# EasyEDA Pro project OSC1.eprj, board 编码器-3
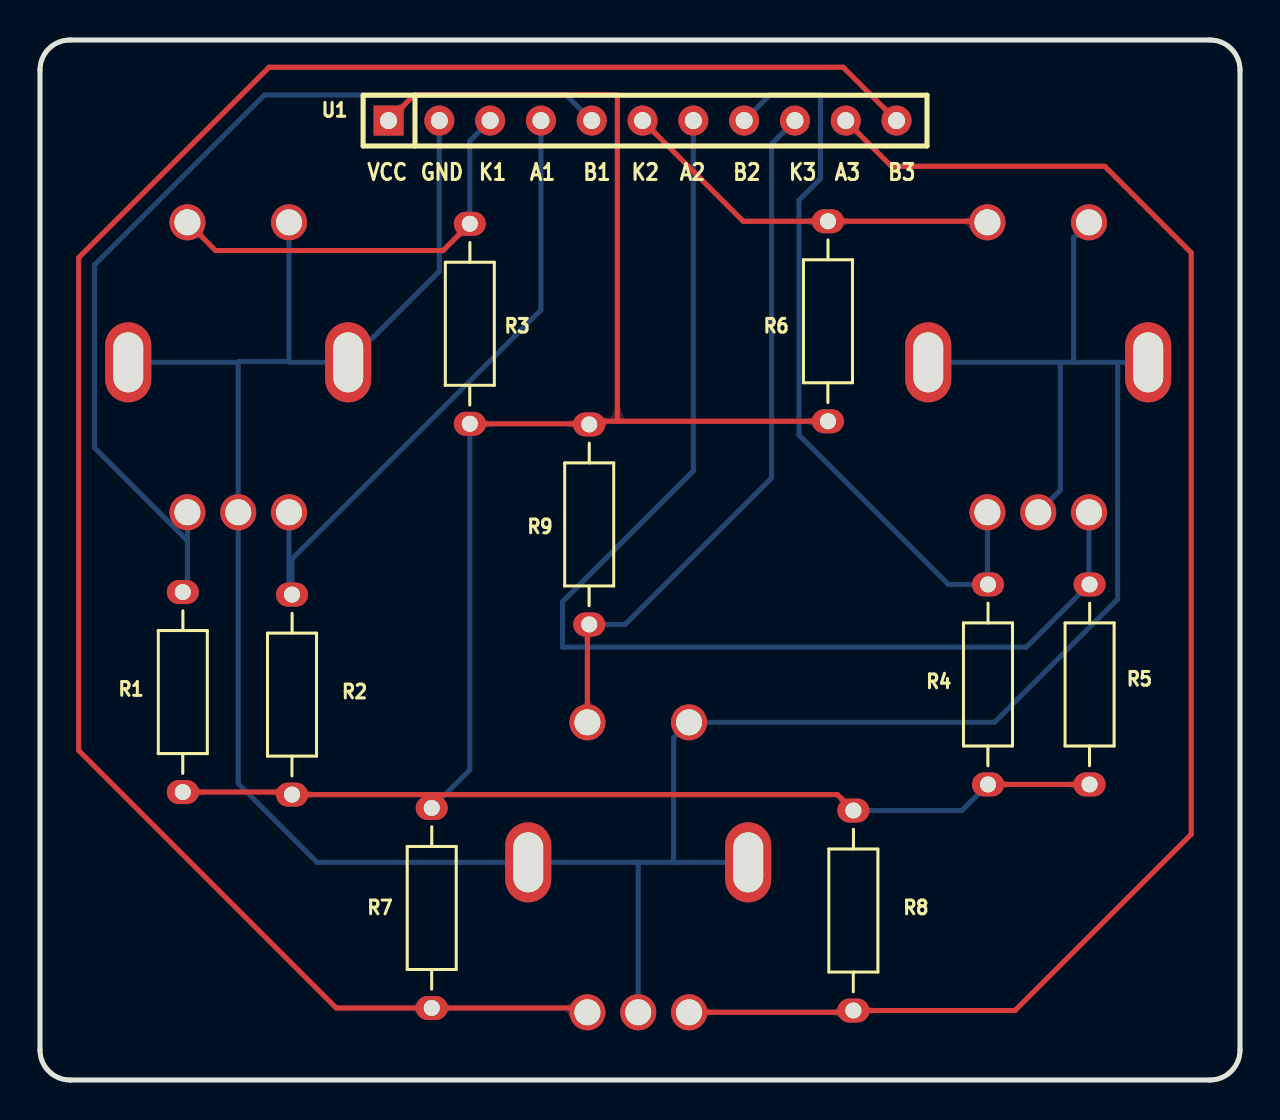
[diagram p13: board, top side]
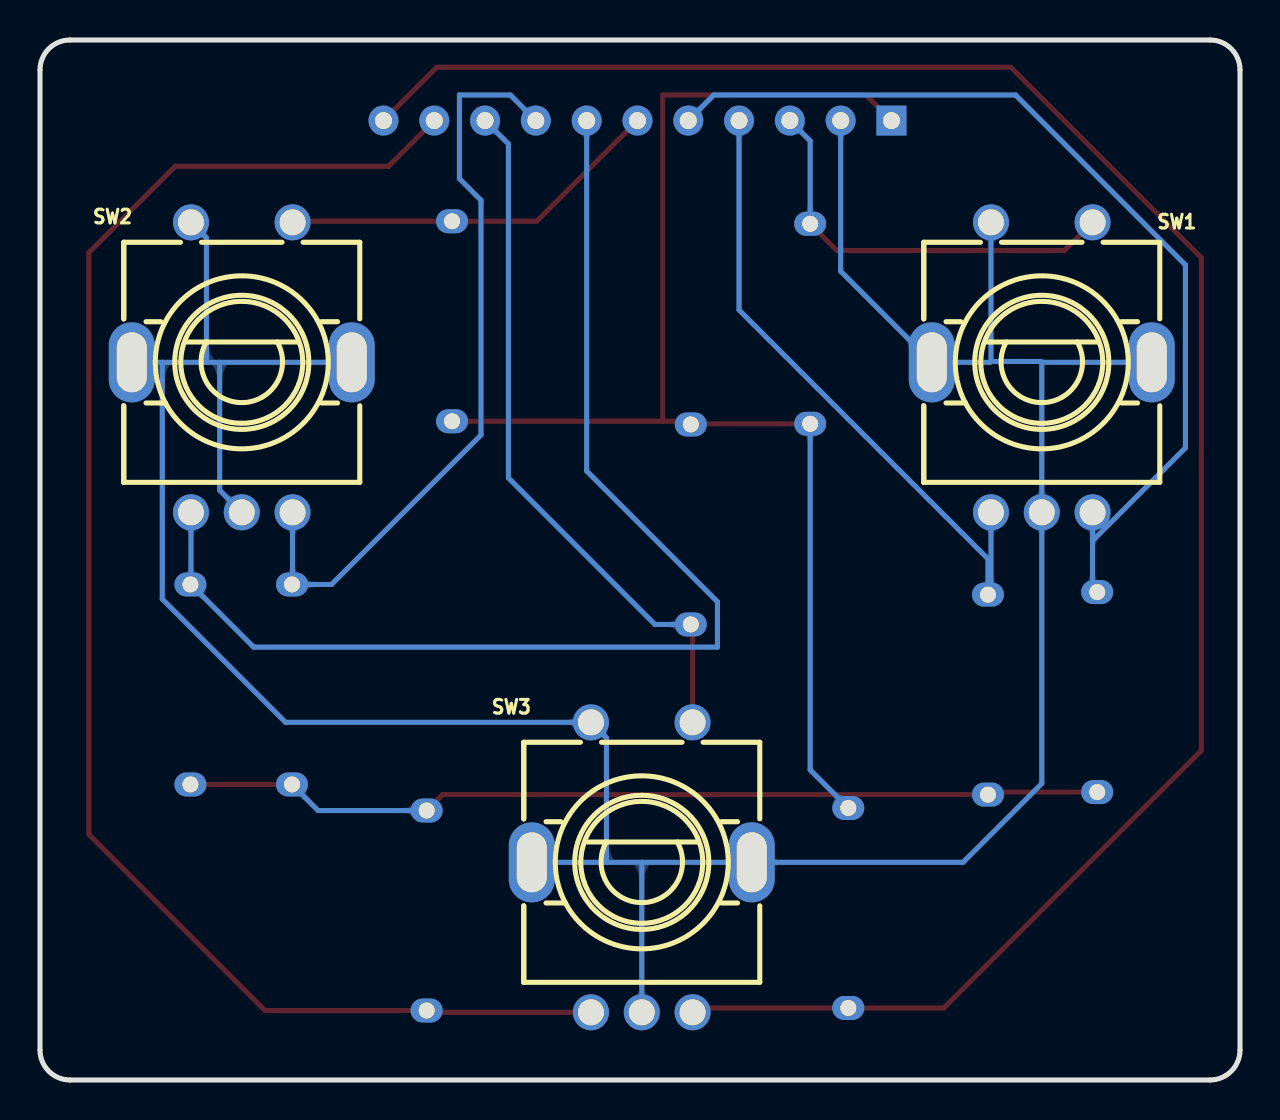
[diagram p14: board, bottom side, seen from below]

Outline 60 x 52 mm; copper layers: Top Layer, Bottom Layer. Coordinates in mm from the lower left corner of the outline.
Outline path: 0,50.5 0,1.5 arc(0.44,0.44) 1.5,0 58.5,0 arc(59.56,0.44) 60,1.5 60,50.5 arc(59.56,51.56) 58.5,52 1.5,52 arc(0.44,51.56) 0,50.5
Stack: Top Layer 0.035mm / Dielectric1 1.51mm FR4 er 4.5 / Bottom Layer 0.035mm

## Design rules (mm)
template: 自定义配置1
spacing copperThickness1oz (default): track to track 0.203, other pairs 0.203 to 0.203
spacing copperThickness2oz: track to track 0.203, other pairs 0.152 to 0.3
track width copperThickness1oz (default): min 0.254, default 0.254, max 2.54
track width copperThickness2oz: min 0.203, default 0.254, max 2.54
track width 5VandGND: min 0.254, default 0.762, max 2.54
differential pair differentialPair (default): width min 0.127, default 0.254, max 2.54; gap min 0.152, default 0.152
via viaSize (default): diameter min 0.5, default 0.61, max 10; hole min 0.3, default 0.305, max 6.299

## Placement (name value [footprint] x y rotation side)
R1  10K  [240*80mil]  7.14 19.4 270 top
R2  10K  [240*80mil]  12.6 19.27 270 top
R3  10K  [240*80mil]  21.49 37.81 270 top
R4  10K  [240*80mil]  47.4 19.78 270 top
R5  10K  [240*80mil]  52.48 19.78 270 top
R6  10K  [240*80mil]  39.4 37.94 270 top
R7  10K  [240*80mil]  19.59 8.6 90 top
R8  10K  [240*80mil]  40.67 8.47 90 top
R9  10K  [240*80mil]  27.46 27.78 90 top
SW1  -  [旋转编码器]  9.91 35.91 180 bottom
SW2  -  [旋转编码器]  49.91 35.91 180 bottom
SW3  -  [旋转编码器]  29.91 10.91 180 bottom
U1  -  [CH2.54-11插座]  28.73 47.97 0 top

## Footprints (pads in the part's own frame, mm; a bottom-side part is the same pattern mirrored in y, then rotated)
240*80mil
  oval 1.2x1.6 hole 0.8: 1(-5,0) 2(5,0)
CH2.54-11插座
  rect 1.5x1.5 hole 0.85: 1(-11.303,0)
  round 1.5 hole 0.85: 2(-8.763,0) 3(-6.223,0) 4(-3.683,0) 5(-1.143,0) 6(1.397,0) 7(3.937,0) 8(6.477,0) 9(9.017,0) 10(11.557,0) 11(14.097,0)
旋转编码器
  oval 2.301x4 hole 1.501x2.999: 6(5.499,-0.023) 7(-5.499,-0.023)
  round 1.801 hole 1.3: A(-2.54,-7.521) B(2.54,-7.521) C(0,-7.521) D(-2.54,6.977) E(2.54,6.977)

## Nets
As in the schematic.

## Routing (per net, layer and track width the routed paths; a pad name or vN(x,y) marks a point on that pad's centre or on a via; arc(x,y) is an arc through that point)
GND: length 157.1
  Bottom Layer w0.254: 31.68,10.88 SW3.7 ; 31.68,10.88 31.68,17.11 SW3.D 47.72,17.88 53.88,24.05 53.88,35.88 ; 31.68,10.88 29.91,10.88 ; 12.45,35.93 12.49,35.88 SW1.7 19.97,40.44 19.97,47.97 ; 12.45,35.93 SW1.D ; 12.45,35.93 9.95,35.93 9.91,35.88 ; 29.91,3.38 29.91,10.88 ; 29.91,10.88 SW3.6 13.85,10.88 9.91,14.82 SW1.C 9.91,35.88 ; SW2.C 51.02,29.49 51.02,35.88 ; SW2.6 51.02,35.88 ; 51.02,35.88 51.68,35.88 ; SW2.7 53.88,35.88 ; 53.88,35.88 51.68,35.88 ; SW2.D 51.68,42.11 51.68,35.88 ; 9.91,35.88 SW1.6
VCC: length 113.2
  Top Layer w0.254: U1.1 18.71,49.25 28.87,49.25 28.87,32.94 ; 27.46,32.81 27.59,32.94 28.87,32.94 ; 27.46,32.81 R3.2 ; 27.46,32.81 R9.2 ; 19.59,14.27 R2.2 12.47,14.4 R1.2 ; 19.59,14.27 R7.2 ; 19.59,14.27 39.87,14.27 R8.2 ; R5.2 R4.2 ; 28.87,32.94 R6.2
  Bottom Layer w0.254: R4.2 46.1,13.47 R8.2 ; R7.2 21.49,15.51 R3.2
A1: length 33
  Bottom Layer w0.254: SW1.A 12.45,24.42 R2.1 12.6,26.06 25.05,38.5 U1.4
A2: length 60.3
  Bottom Layer w0.254: 52.45,24.78 49.32,21.64 26.13,21.64 26.13,23.91 32.67,30.45 U1.7 ; 52.45,24.78 R5.1 ; 52.45,24.78 SW2.A
A3: length 77.9
  Top Layer w0.254: 32.45,3.38 40.58,3.38 R8.1 48.75,3.47 57.56,12.28 57.56,41.37 53.24,45.69 42.57,45.69 40.29,47.97
B1: length 48.7
  Bottom Layer w0.254: U1.5 26.31,49.25 11.22,49.25 2.73,40.75 2.73,31.61 7.37,26.97 ; R1.1 7.37,24.63 7.37,26.97 ; 7.37,26.97 SW1.B
B2: length 37.9
  Bottom Layer w0.254: R4.1 47.37,24.78 ; 47.37,24.78 45.42,24.78 37.95,32.25 37.95,43.99 39.03,45.07 39.03,49.25 36.49,49.25 U1.8 ; 47.37,24.78 SW2.B
B3: length 101.4
  Top Layer w0.254: U1.11 40.16,50.64 11.46,50.64 1.93,41.11 1.93,16.48 14.81,3.6 R7.1 27.16,3.6 27.37,3.38
KEY1: length 20.8
  Top Layer w0.254: R3.1 20.15,41.47 8.78,41.47 SW1.E
  Bottom Layer w0.254: R3.1 21.49,46.95 22.51,47.97
KEY2: length 19.4
  Top Layer w0.254: 30.13,47.97 35.16,42.94 R6.1 47.32,42.94 SW2.E
KEY3: length 35.4
  Top Layer w0.254: SW3.E 27.37,22.69 R9.1
  Bottom Layer w0.254: R9.1 29.25,22.78 36.58,30.1 36.58,46.8 U1.9

## Copper pours and planes (outline as drawn; the poured copper is in the pictures)
GND on Top Layer: -3.66,56.61 64.93,56.61 64.93,-6.13 -3.66,-6.13
GND on Bottom Layer: -3.91,56.1 64.42,56.1 64.42,-6.64 -3.91,-6.64

Small or netless copper shapes (teardrops, artwork), in the pictures only: 31 on Top Layer, 46 on Bottom Layer

## Text on the board
Top Silkscreen Layer: GND | VCC | K1 | A1 | B1 | K2 | A2 | B2 | K3 | A3 | B3
